# Altium schematic sheet IO Level Shifters.SchDoc: IO Level Shifters
size B; Organization: Drexel University; Address1: ECE Senior Design; Address2: 2018-2019; Address3: ECE-08; Revision: 1.0; SheetNumber: 4; SheetTotal: 9
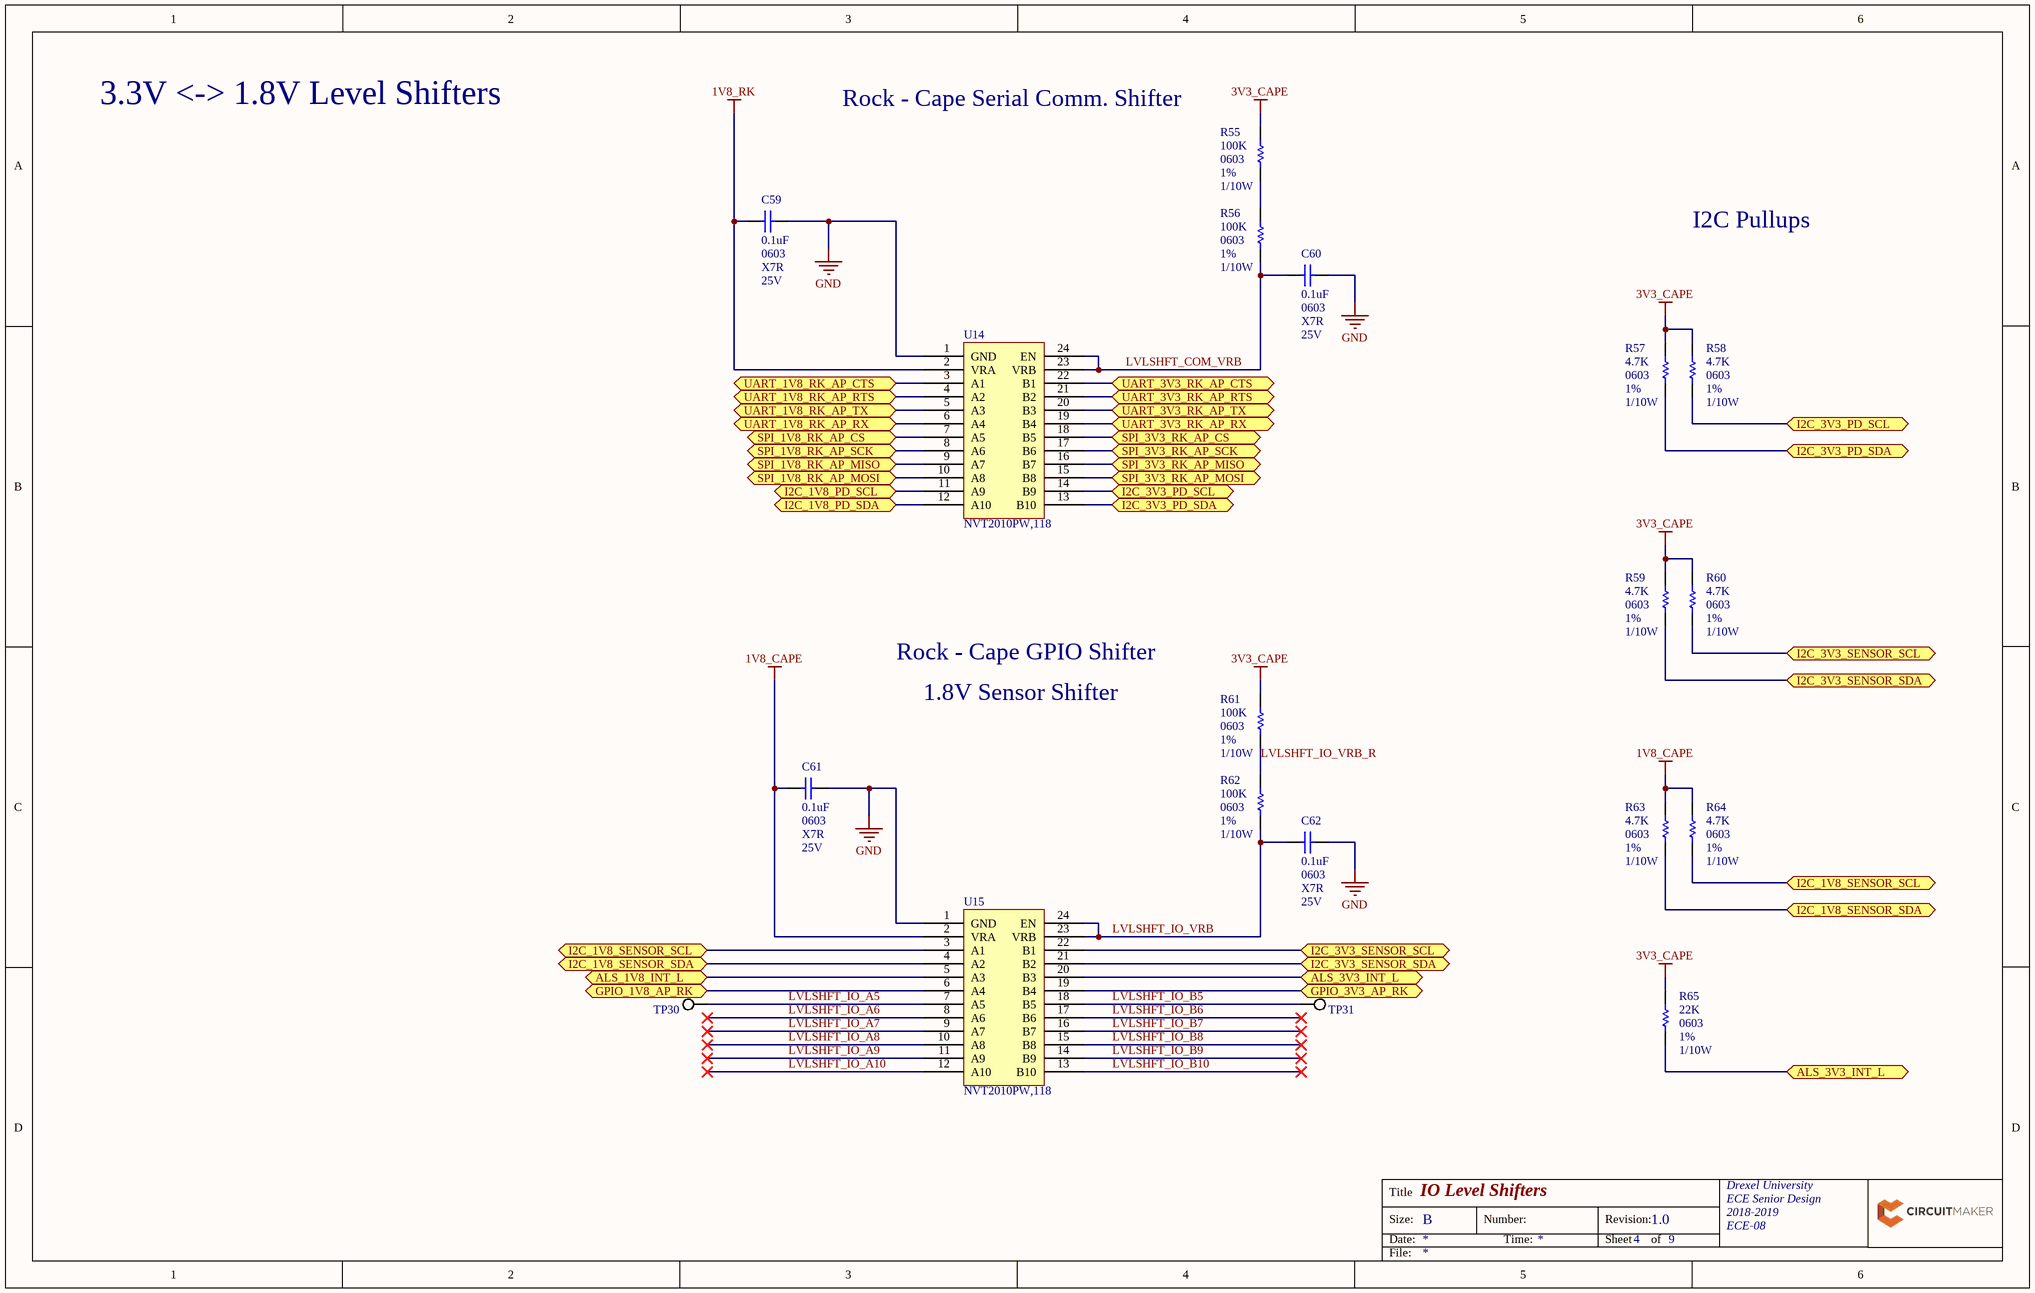
[diagram p0: IO Level Shifters.SchDoc]

## Parts
C59  Dielectric Characteristic: X7R  Voltage Rating (DC): 25V  Capacitance: 0.1uF  Package: 0603  [PCB-8usp83j76ntw2xroyu3n-1]  (hidden comment: Würth Elektronik 885012206071)
C60  Dielectric Characteristic: X7R  Voltage Rating (DC): 25V  Capacitance: 0.1uF  Package: 0603  [PCB-8usp83j76ntw2xroyu3n-1]  (hidden comment: Würth Elektronik 885012206071)
C61  Dielectric Characteristic: X7R  Voltage Rating (DC): 25V  Capacitance: 0.1uF  Package: 0603  [PCB-8usp83j76ntw2xroyu3n-1]  (hidden comment: Würth Elektronik 885012206071)
C62  Dielectric Characteristic: X7R  Voltage Rating (DC): 25V  Capacitance: 0.1uF  Package: 0603  [PCB-8usp83j76ntw2xroyu3n-1]  (hidden comment: Würth Elektronik 885012206071)
R55  Resistance: 100K  Power Rating: 1/10W  Package: 0603  Tolerance: 1%  [PCB-js3e944hkesj3cskg8px-1]  (hidden comment: Res1)
R56  Resistance: 100K  Power Rating: 1/10W  Package: 0603  Tolerance: 1%  [PCB-js3e944hkesj3cskg8px-1]  (hidden comment: Res1)
R57  Resistance: 4.7K  Package: 0603  Power Rating: 1/10W  Tolerance: 1%  [CAPC1608X90X35NL15T15]  (hidden comment: 4k7)
R58  Resistance: 4.7K  Package: 0603  Power Rating: 1/10W  Tolerance: 1%  [CAPC1608X90X35NL15T15]  (hidden comment: 4k7)
R59  Resistance: 4.7K  Package: 0603  Power Rating: 1/10W  Tolerance: 1%  [CAPC1608X90X35NL15T15]  (hidden comment: 4k7)
R60  Resistance: 4.7K  Package: 0603  Power Rating: 1/10W  Tolerance: 1%  [CAPC1608X90X35NL15T15]  (hidden comment: 4k7)
R61  Resistance: 100K  Power Rating: 1/10W  Package: 0603  Tolerance: 1%  [PCB-js3e944hkesj3cskg8px-1]  (hidden comment: Res1)
R62  Resistance: 100K  Power Rating: 1/10W  Package: 0603  Tolerance: 1%  [PCB-js3e944hkesj3cskg8px-1]  (hidden comment: Res1)
R63  Resistance: 4.7K  Package: 0603  Power Rating: 1/10W  Tolerance: 1%  [CAPC1608X90X35NL15T15]  (hidden comment: 4k7)
R64  Resistance: 4.7K  Package: 0603  Power Rating: 1/10W  Tolerance: 1%  [CAPC1608X90X35NL15T15]  (hidden comment: 4k7)
R65  Resistance: 22K  Resistance Tolerance: 1%  Case/Package: 0603  Power Rating: 1/10W  [RESC1608X55X25LL10T15]  (hidden comment: Yageo RC0603FR-0722KL)
TP30  SYM-r3tntvff39g057zxjnnx-1  [PCB-hew5anfrhkqvtgt23eko-1]  (value not drawn)
TP31  SYM-r3tntvff39g057zxjnnx-1  [PCB-hew5anfrhkqvtgt23eko-1]  (value not drawn)
U14  NVT2010PW,118  [PCBComponent_1 - duplicate]
U15  NVT2010PW,118  [PCBComponent_1 - duplicate]

## Ports
ALS_1V8_INT_L, ALS_3V3_INT_L, GPIO_1V8_AP_RK, GPIO_3V3_AP_RK, I2C_1V8_PD_SCL, I2C_1V8_PD_SDA, I2C_1V8_SENSOR_SCL, I2C_1V8_SENSOR_SDA, I2C_3V3_PD_SCL, I2C_3V3_PD_SDA, I2C_3V3_SENSOR_SCL, I2C_3V3_SENSOR_SDA, SPI_1V8_RK_AP_CS, SPI_1V8_RK_AP_MISO, SPI_1V8_RK_AP_MOSI, SPI_1V8_RK_AP_SCK, SPI_3V3_RK_AP_CS, SPI_3V3_RK_AP_MISO, SPI_3V3_RK_AP_MOSI, SPI_3V3_RK_AP_SCK, UART_1V8_RK_AP_CTS, UART_1V8_RK_AP_RTS, UART_1V8_RK_AP_RX, UART_1V8_RK_AP_TX, UART_3V3_RK_AP_CTS, UART_3V3_RK_AP_RTS, UART_3V3_RK_AP_RX, UART_3V3_RK_AP_TX

## Nets
1V8_CAPE: C61.1 R63.2 R64.2 U15.2(VRA)
1V8_RK: C59.1 U14.2(VRA)
3V3_CAPE: R55.2 R57.2 R58.2 R59.2 R60.2 R61.2 R65.2
GND: C59.2 C60.2 C61.2 C62.2 U14.1(GND) U15.1(GND)
ALS_1V8_INT_L: U15.5(A3) ; port ALS_1V8_INT_L
ALS_3V3_INT_L: R65.1 U15.20(B3) ; port ALS_3V3_INT_L
GPIO_1V8_AP_RK: U15.6(A4) ; port GPIO_1V8_AP_RK
GPIO_3V3_AP_RK: U15.19(B4) ; port GPIO_3V3_AP_RK
I2C_1V8_PD_SCL: U14.11(A9) ; port I2C_1V8_PD_SCL
I2C_1V8_PD_SDA: U14.12(A10) ; port I2C_1V8_PD_SDA
I2C_1V8_SENSOR_SCL: R64.1 U15.3(A1) ; port I2C_1V8_SENSOR_SCL
I2C_1V8_SENSOR_SDA: R63.1 U15.4(A2) ; port I2C_1V8_SENSOR_SDA
I2C_3V3_PD_SCL: R58.1 U14.14(B9) ; port I2C_3V3_PD_SCL
I2C_3V3_PD_SDA: R57.1 U14.13(B10) ; port I2C_3V3_PD_SDA
I2C_3V3_SENSOR_SCL: R60.1 U15.22(B1) ; port I2C_3V3_SENSOR_SCL
I2C_3V3_SENSOR_SDA: R59.1 U15.21(B2) ; port I2C_3V3_SENSOR_SDA
LVLSHFT_COM_VRB: C60.1 R56.1 U14.23(VRB) U14.24(EN)
LVLSHFT_IO_A5: TP30.1 U15.7(A5)
LVLSHFT_IO_A6: U15.8(A6)
LVLSHFT_IO_A7: U15.9(A7)
LVLSHFT_IO_A8: U15.10(A8)
LVLSHFT_IO_A9: U15.11(A9)
LVLSHFT_IO_A10: U15.12(A10)
LVLSHFT_IO_B5: TP31.1 U15.18(B5)
LVLSHFT_IO_B6: U15.17(B6)
LVLSHFT_IO_B7: U15.16(B7)
LVLSHFT_IO_B8: U15.15(B8)
LVLSHFT_IO_B9: U15.14(B9)
LVLSHFT_IO_B10: U15.13(B10)
LVLSHFT_IO_VRB: C62.1 R62.1 U15.23(VRB) U15.24(EN)
LVLSHFT_IO_VRB_R: R61.1 R62.2
SPI_1V8_RK_AP_CS: U14.7(A5) ; port SPI_1V8_RK_AP_CS
SPI_1V8_RK_AP_MISO: U14.9(A7) ; port SPI_1V8_RK_AP_MISO
SPI_1V8_RK_AP_MOSI: U14.10(A8) ; port SPI_1V8_RK_AP_MOSI
SPI_1V8_RK_AP_SCK: U14.8(A6) ; port SPI_1V8_RK_AP_SCK
SPI_3V3_RK_AP_CS: U14.18(B5) ; port SPI_3V3_RK_AP_CS
SPI_3V3_RK_AP_MISO: U14.16(B7) ; port SPI_3V3_RK_AP_MISO
SPI_3V3_RK_AP_MOSI: U14.15(B8) ; port SPI_3V3_RK_AP_MOSI
SPI_3V3_RK_AP_SCK: U14.17(B6) ; port SPI_3V3_RK_AP_SCK
UART_1V8_RK_AP_CTS: U14.3(A1) ; port UART_1V8_RK_AP_CTS
UART_1V8_RK_AP_RTS: U14.4(A2) ; port UART_1V8_RK_AP_RTS
UART_1V8_RK_AP_RX: U14.6(A4) ; port UART_1V8_RK_AP_RX
UART_1V8_RK_AP_TX: U14.5(A3) ; port UART_1V8_RK_AP_TX
UART_3V3_RK_AP_CTS: U14.22(B1) ; port UART_3V3_RK_AP_CTS
UART_3V3_RK_AP_RTS: U14.21(B2) ; port UART_3V3_RK_AP_RTS
UART_3V3_RK_AP_RX: U14.19(B4) ; port UART_3V3_RK_AP_RX
UART_3V3_RK_AP_TX: U14.20(B3) ; port UART_3V3_RK_AP_TX
NetR55_1: R55.1 R56.2

## Notes on the sheet
- 3.3V <-> 1.8V Level Shifters
- (near R55) Rock - Cape Serial Comm. Shifter
- I2C Pullups
- Rock - Cape GPIO Shifter
- 1.8V Sensor Shifter
- Title
- Size:
- Date:
- B
- Number:
- Time:
- Revision:
- Sheet
- of
- File:

## Library data of the parts
C59-C62 = CMP-034ac9768ab0dc8d-1: Multilayer Ceramic Capacitor, WCAP-CSGP Series, 0.1 F, 10%, X7R, 25 V, 0603 [1608 Metric]; RoHS: Compliant; Capacitance Tolerance: ±10%; OctopartID: 034ac9768ab0dc8d; Packaging: Cut Tape (CT); Octopart URL: http://octopart.com/885012206071-w%C3%BCrth+elektronik-53914780; Manufacturer Part Number: 885012206071
R55 R56 R61 R62 = CMP-47e38e6423219824-1: Res Thick Film 0603 100K Ohm 1% 0.1W(1/10W) ±100ppm/C Pad SMD T/R
R57-R60 R63 R64 = CMP-3ca7f596181de360-9: Res Thick Film 0603 4.7K Ohm 1% 1/10W ±100ppm/°C Molded SMD SMD Paper Tape on Plastic Reel
R65 = CMP-1853446-5: Chip Resistor, 22 KOhm, +/- 1%, 0.1 W, -55 to 155 degC, 0603 (1608 Metric), RoHS, Tape and Reel; Voltage Rating (DC): 50.0 V; Lead-Free Status: Lead Free; Case/Package (SI): 1608; Number of Pins: 2; Size-Height: 450 µm; PackageDescription: 2-Pin Surface Mount Device, Body 1.6 x 0.8 mm; Size-Width: 800 µm; Seller Landing  Url: https://octopart-clicks.com/click/track?country=US&ak=8157f166&sig=0952a08&sid=5489&ppid=40952860&vpid=270386233&ct=offers; DatasheetVersion: Rev. 4, 02/2016; PackageReference: 0603; Size-Length: 1.60 mm; RoHS: Compliant; Mounting Style: Surface Mount; OctopartID: 2162ea18e018fea5; Manufacturer Part Number: RC0603FR-0722KL; Packaging: Cut Tape (CT), Tape & Reel (TR); Octopart Url: http://octopart.com/rc0603fr-0722kl-yageo-40952860; REACH SVHC Compliance: No SVHC
TP30 TP31 = CMP-r3tntvff39g057zxjnnx-3: SMT Pad Test Point 1.27mm Diameter
U14 U15 = CMP-e872205300dc37b5-1: Voltage Level Translator 24-Pin TSSOP T/R; Supply Voltage (DC): 5.50 V (max), 1.80 V (min); Lead-Free Status: Lead Free; Lifecycle Status: Active; OctopartID: e872205300dc37b5; Octopart URL: https://octopart.com/nvt2010pw%2C118-nxp+semiconductors-19647944; Manufacturer Part Number: NVT2010PW,118